# Altium schematic sheet BSPD_Timing.SchDoc: BSPD: Timing
size A4; DrawnBy: Pol Feliu; DocumentNumber: 1; Revision: 1; SheetNumber: 1; SheetTotal: 4; University: UPC EEBE; City: Barcelona; Country: Spain; CP: 08019; Address: Av. Eduard Maristany, 16
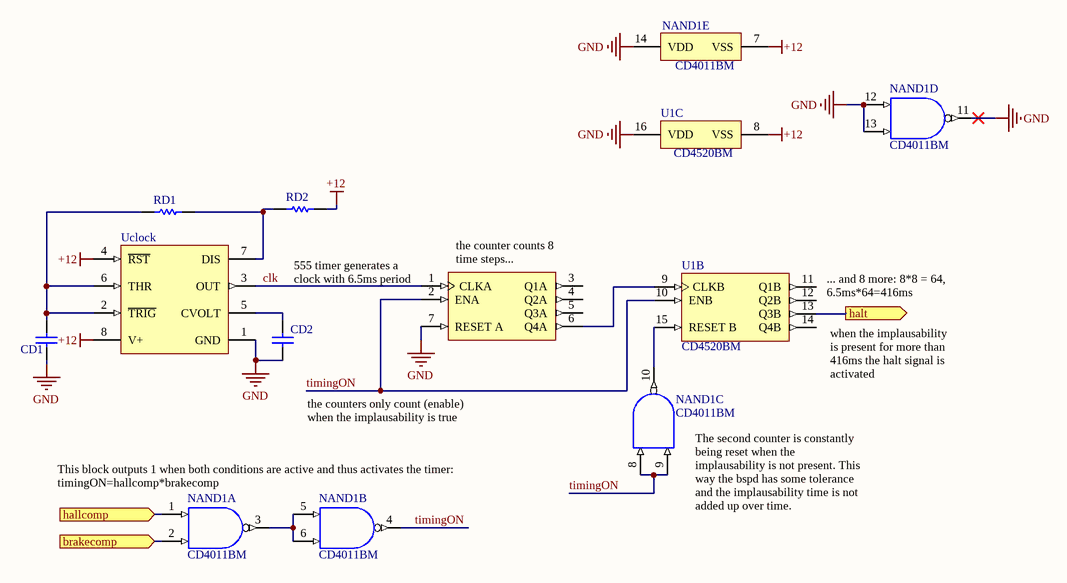
[diagram p0: BSPD_Timing.SchDoc]

## Parts
CD1  CAP 68nF  [CAPC1206(3216)100_M]  (value not drawn)
CD2  CAP 10nF  [CAPC1206(3216)110_M]  (value not drawn)
NAND1  CD4011BM  [D0014A_M]  (parts A,B,C,D,E of 5)
RD1  68K  [RESC1206(3216)_M]  (value not drawn)
RD2  1K1  [RESC1206(3216)_M]  (value not drawn)
U1  CD4520BM  [D0016A_M]  (value not drawn)  (parts A,B,C of 3)
Uclock  LMC555CM/NOPB  [D0008A_M]  (value not drawn)

## Ports
brakecomp (in), hallcomp (in), halt (out)

## Nets
+12: NAND1.7(VSS) RD2.2 U1.8(VSS) Uclock.4(~{RST}) Uclock.8(V+)
GND: CD1.2 CD2.2 NAND1.11(M) NAND1.12(G) NAND1.13(H) NAND1.14(VDD) U1.7(RESET_A) U1.16(VDD) Uclock.1(GND)
brakecomp: NAND1.2(B) ; port brakecomp
clk: U1.1(CLKA) Uclock.3(OUT)
hallcomp: NAND1.1(A) ; port hallcomp
halt: U1.13(Q3B) ; port halt
timingON: NAND1.4(K) NAND1.8(E) NAND1.9(F) U1.2(ENA) U1.10(ENB)
NetCD1_1: CD1.1 RD1.1 Uclock.2(~{TRIG}) Uclock.6(THR)
NetCD2_1: CD2.1 Uclock.5(CVOLT)
NetNAND1_3: NAND1.3(J) NAND1.5(C) NAND1.6(D)
NetNAND1_10: NAND1.10(L) U1.15(RESET_B)
NetRD1_2: RD1.2 RD2.1 Uclock.7(DIS)
NetU1_6: U1.6(Q4A) U1.9(CLKB)

Not connected (* = marked no-connect by the designer): U1 3(Q1A) 4(Q2A) 5(Q3A) 11(Q1B) 12(Q2B) 14(Q4B)

## Notes on the sheet
- 555 timer generates a clock with 6.5ms period
- (near U1) the counter counts 8 time steps...
- (near U1) ... and 8 more: 8*8 = 64, 6.5ms*64=416ms
- (near U1) when the implausability is present for more than 416ms the halt signal is activated
- the counters only count (enable) when the implausability is true
- (near NAND1) This block outputs 1 when both conditions are active and thus activates the timer: timingON=hallcomp*brakecomp
- (near NAND1) The second counter is constantly being reset when the implausability is not present. This way the bspd has some tolerance and the implausability time is not added up over time.
- Title
- e-Tech Racing
- UPC EEBE
- Size:
- Date:
- Drawn by:
- A4
- Number:
- Time:
- Revision:
- Sheet
- of
- Av. Eduard Maristany, 16
- 08019
- Barcelona Spain
- Made with:
- Checked by:

## Library data of the parts
CD1 = CMP-1037-04097-1: CAP 68nF 50V -20% to +80% 1206 (3216 Metric) Thickness 1mm SMD; Case-Metric: 3216; Case-EIA: 1206; Technology: SMT; Tolerance: -20% to +80%; Max Thickness: 1 mm; Value: 68nF; Rated Voltage: 50 V
CD2 = CMP-1037-04841-1: CAP 10nF 10V ±10% 1206 (3216 Metric) Thickness 1.05mm SMD; Case-Metric: 3216; Tolerance: Â±10%; Case-EIA: 1206; Value: 2.7uF; Max Thickness: 1.05 mm; Rated Voltage: 10 V; Technology: SMT
NAND1 = CMP-1627-00066-2: CMOS Quad 2-Input NAND Gate, D0014A, TUBE; Manufacturer: Texas Instruments; Output Drive (IOL/IOH)(Max)(mA): 1.5/-1.5; Schmitt Trigger: No; Bits(#): 4; Voltage(Nom)(V): 10; F @ Nom Voltage(Max)(Mhz): 8; VCC(Min)(V): 3; Technology Family: CD4000; Rating: Military; VCC(Max)(V): 18; ICC @ Nom Voltage(Max)(mA): 0.015; Code_JEDEC: MS-012; DatasheetVersion: SCHS021D; Generic Part Number: CD4011B; Output Type: CMOS; PackageReference: D0014A; Input Type: CMOS; Operating Temperature Range(C): -55 to 125
RD1 = CMP-1014-00118-1: 68K 0.25W 5% 1206 (3216 Metric)  SMD; Value: 68000.00 Ohm; Case-Metric: 3216; Case-EIA: 1206; Tolerance: 5 %; Technology: SMT; Power: 0.25 W
RD2 = CMP-1014-00075-1: 1K1 0.25W 5% 1206 (3216 Metric)  SMD; Case-EIA: 1206; Value: 1100.00 Ohm; Case-Metric: 3216; Technology: SMT; Power: 0.25 W; Tolerance: 5 %
U1 = CMP-1623-00148-2: CMOS Dual Binary Up-Counter, D0016A, TUBE; Manufacturer: Texas Instruments; VCC(Max)(V): 18; Output Drive (IOL/IOH)(Max)(mA): 1.5/-1.5; Technology Family: CD4000; tpd @ Nom Voltage(Max)(ns): 230; Voltage(Nom)(V): 5,10,15; Inputs: 1; Bits(#): 4; Rating: Catalog; VCC(Min)(V): 3; F @ Nom Voltage(Max)(Mhz): 8; ICC @ Nom Voltage(Max)(mA): 0.03; Schmitt Trigger: No; DatasheetVersion: SCHS076D; Input Type: CMOS; Generic Part Number: CD4520B; Operating Temperature Range(C): -55 to 125; Output Type: CMOS; Function: Counter; Type: Binary; PackageReference: D0016A; Code_JEDEC: MS-012 variation AC
Uclock = CMP-0056-00124-3: CMOS Timer, 8-pin Narrow SOIC, Pb-Free; Manufacturer: Texas Instruments; PowerWise: N; CompType: Analog IC; PackageTopMarking: NSZXTT*LMC*555CM; PackageReference: D0008A; Code_IPC: SOIC127P600-8; RoHS: Y; PinCount: 8; PackageDescription: SOIC Narrow, 4.9 x 3.9 x 1.45mm, 8 Lead, 1.27mm Pitch; Code_JEDEC: MS-012-AA; ComponentLink1Description: Datasheet URL; ComponentLink1URL: http://www.ti.com/general/docs/lit/getliterature.tsp?genericPartNumber=LMC555&fileType=pdf